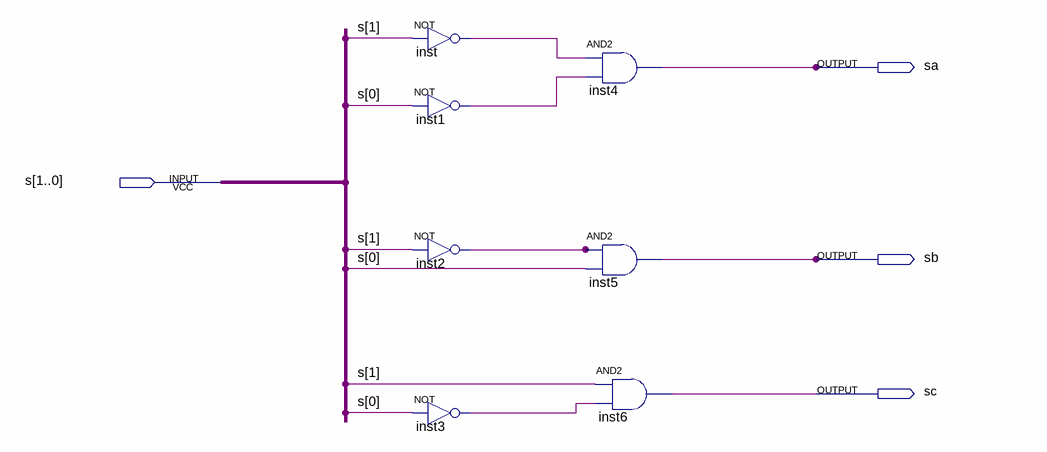
[diagram p0: schematic sheet]
// Quartus schematic destination.bdf as structural Verilog: 7 symbols, 4 pins
module destination (
  input  [1:0] s,
  output sa,
  output sb,
  output sc
);

  wire inst1_out, inst2_out, inst3_out, inst_out;

  not inst (inst_out, s[1]);
  not inst1 (inst1_out, s[0]);
  not inst2 (inst2_out, s[1]);
  not inst3 (inst3_out, s[0]);
  and inst4 (sa, inst_out, inst1_out);
  and inst5 (sb, inst2_out, s[0]);
  and inst6 (sc, s[1], inst3_out);
endmodule
